# Altium schematic sheet WX0.008.512DL(4).SchDoc
size A3; PageSetup: Record=PageOptions|CenterHorizontal=True|CenterVertical=True|PrintScale=0.73|XCorrection=1.00|YCorrection=1.00|PrintKind=1|BorderSize=5000000|LeftOffset=0|BottomOffset=0|Orientation=2|PaperLength=1000|PaperWidth=1000|Scale=100|PaperSource=7|PrintQuality=-3|MediaType=1|DitherType=10|PrintScaleMode=1|PaperKind=A4 (210 x 297 毫米)|PaperIndex=9
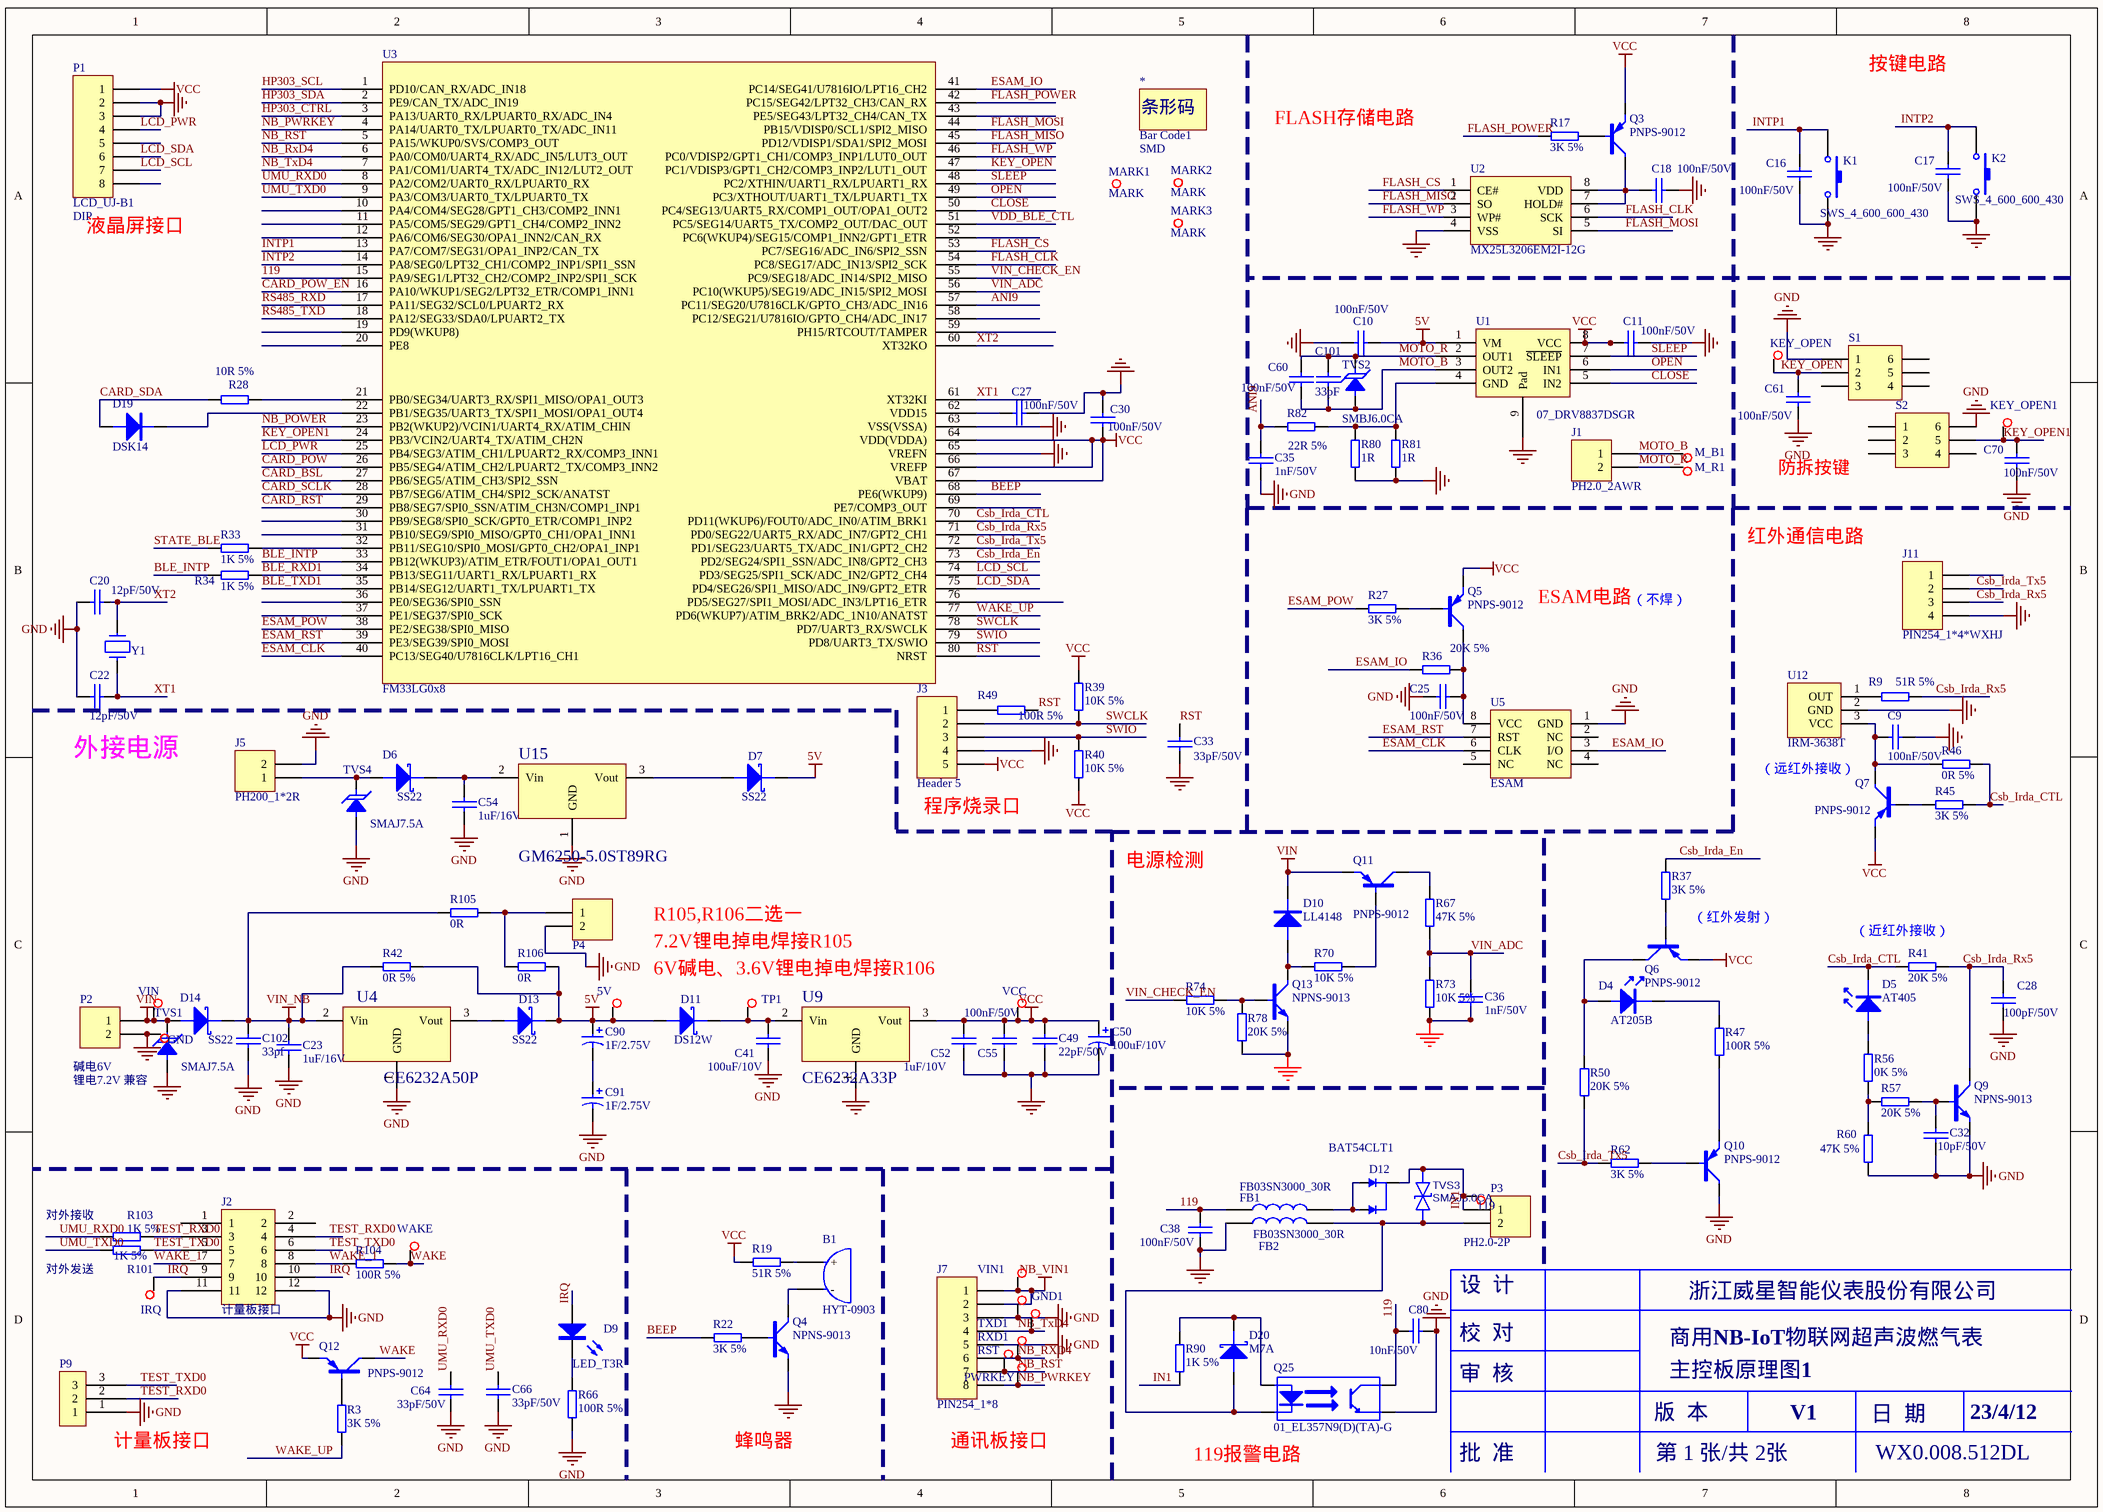
[diagram p0: WX0.008.512DL(4).SchDoc]

## Parts
5V  TEST-PAD  [TEST-PAD]  (value not drawn)
119  TEST-PAD  [TEST-PAD]  (value not drawn)
*  Bar Code1  SMD/DIP: SMD  [Bar Code1]
B1  HYT-0903  [HYT-0903]
C9  100nF/50V  [CAP0603]
C10  100nF/50V  [CAP0603]
C11  100nF/50V  [CAP0603]
C16  100nF/50V  [CAP0603]
C17  100nF/50V  [CAP0603]
C18  100nF/50V  [CAP0603]
C20  12pF/50V  [CAP0603]
C22  12pF/50V  [CAP0603]
C23  1uF/16V  [CAP0603]
C25  100nF/50V  [CAP0603]
C27  100nF/50V  [CAP0603]
C28  100pF/50V  [CAP0603]
C30  100nF/50V  [CAP0603]
C32  10pF/50V  [CAP0603]
C33  33pF/50V  [CAP0603]
C35  1nF/50V  [CAP0603]
C36  1nF/50V  [CAP0603]
C38  100nF/50V  [CAP0603]
C41  100uF/10V  [GRM31CR60J107ME39L]
C49  22pF/50V  [CAP0603]
C50  100uF/10V  [GRM31CR60J107ME39L]
C52  1uF/10V  [CAP0603]
C54  1uF/16V  [CAP0603]
C55  100nF/50V  [CAP0603]
C60  100nF/50V  [CAP0603]
C61  100nF/50V  [CAP0603]
C64  33pF/50V  [CAP0603]
C66  33pF/50V  [CAP0603]
C70  100nF/50V  [CAP0603]
C80  10nF/50V  [CAP0603]
C90  1F/2.75V  [CAPPC_350_800_1600]
C91  1F/2.75V  [CAPPC_350_800_1600]
C101  33pF  [CAP0603]
C102  33pf  [CAP0603]
D4  AT205B  [LEDRED]
D5  AT405  [IR_254_1000_500]
D6  SS22  [DO-214AC]
D7  SS22  [DO-214AC]
D9  LED_T3R  [LED2_300]
D10  LL4148  [SOD-123FL]
D11  DS12W  [SOD-123FL]
D12  BAT54CLT1  [SOT-23]
D13  SS22  [DO-214AC]
D14  SS22  [DO-214AC]
D19  DSK14  [SOD-123FL]
D20  M7A  [DO-214AC]
FB1  FB03SN3000_30R  [IND0603]
FB2  FB03SN3000_30R  [IND0603]
GND  TEST-PAD  [TEST-PAD]  (value not drawn)
GND1  TEST-PAD  [TEST-PAD]  (value not drawn)
IRQ  TEST-PAD  [TEST-PAD]  (value not drawn)
J1  PH2.0_2AWR  [SMT2-2.0]
J2  计量板接口  [计量板插座 2X6Pin]
J3  Header 5  [HDR1X5]
J5  PH200_1*2R  [SMT2-2.0]
J7  PIN254_1*8  [PCBComponent_1 - duplicate3]
J11  PIN254_1*4*WXHJ  [PIN254_1*4*1100S]
K1  SWS_4_600_600_430  [SWS_4_600_600]
K2  SWS_4_600_600_430  [SWS_4_600_600]
KEY_OPEN  TEST-PAD  [TEST-PAD]  (value not drawn)
KEY_OPEN1  TEST-PAD  [TEST-PAD]  (value not drawn)
M_B1  TEST-PAD  [TEST-PAD]  (value not drawn)
M_R1  TEST-PAD  [TEST-PAD]  (value not drawn)
MARK1  MARK  [MARK]
MARK2  MARK  [MARK]
MARK3  MARK  [MARK]
P1  LCD_UJ-B1  SMD/DIP: DIP  [LCD_JR-H25433AFP]
P2  碱电6V  [Header 2]
P3  PH2.0-2P  [SMT2-2.0]
P4  两节锂电池7.2V  [CONN-SMD_2.0-2PLT]  (value not drawn)
P9  Component_2  [PCBComponent_1 - duplicate]  (value not drawn)
PWRKEY  TEST-PAD  [TEST-PAD]  (value not drawn)
Q3  PNPS-9012  [SOT-23]
Q4  NPNS-9013  [SOT-23]
Q5  PNPS-9012  [SOT-23]
Q6  PNPS-9012  [SOT-23]
Q7  PNPS-9012  [SOT-23]
Q9  NPNS-9013  [SOT-23]
Q10  PNPS-9012  [SOT-23]
Q11  PNPS-9012  [SOT-23]
Q12  PNPS-9012  [SOT-23]
Q13  NPNS-9013  [SOT-23]
Q25  01_EL357N9(D)(TA)-G  [EL357D]
R3  3K 5%  [RES0603]
R9  51R 5%  [RES0603]
R17  3K 5%  [RES0603]
R19  51R 5%  [RES0603]
R22  3K 5%  [RES0603]
R27  3K 5%  [RES0603]
R28  10R 5%  [RES0603]
R33  1K 5%  [RES0603]
R34  1K 5%  [RES0603]
R36  20K 5%  [RES0603]
R37  3K 5%  [RES0603]
R39  10K 5%  [RES0603]
R40  10K 5%  [RES0603]
R41  20K 5%  [RES0603]
R42  0R 5%  [RES1206]
R45  3K 5%  [RES0603]
R46  0R 5%  [RES0603]
R47  100R 5%  [RES0603]
R49  100R 5%  [RES0603]
R50  20K 5%  [RES0603]
R56  0K 5%  [RES0603]
R57  20K 5%  [RES0603]
R60  47K 5%  [RES0603]
R62  3K 5%  [RES0603]
R66  100R 5%  [RES0603]
R67  47K 5%  [RES0603]
R70  10K 5%  [RES0603]
R73  10K 5%  [RES0603]
R74  10K 5%  [RES0603]
R78  20K 5%  [RES0603]
R80  1R  [RES1206]
R81  1R  [RES1206]
R82  22R 5%  [RES0603]
R90  1K 5%  [RES0603]
R101  1K 5%  [RES0603]
R103  1K 5%  [RES0603]
R104  100R 5%  [RES0603]
R105  0R  [RES1206]
R106  0R  [RES1206]
RST  TEST-PAD  [TEST-PAD]  (value not drawn)
RXD1  TEST-PAD  [TEST-PAD]  (value not drawn)
S1  Component_4  [PCBComponent_1 - duplicate5]  (value not drawn)
S2  Component_4  [PCBComponent_1 - duplicate5]  (value not drawn)
TP1  TEST-PAD  [TEST-PAD]  (value not drawn)
TVS1  SMAJ7.5A  [PCBComponent_1 - duplicate4]
TVS2  SMBJ6.0CA  [DO-214AA]
TVS3  SMAJ5.0CA  [SMAJ5.0CA]
TVS4  SMAJ7.5A  [PCBComponent_1 - duplicate4]
TXD1  TEST-PAD  [TEST-PAD]  (value not drawn)
U1  07_DRV8837DSGR  [S-PWSON-N8]
U2  MX25L3206EM2I-12G  [SOP-8L-200MIL/SOP-8]
U3  FM33LG0x8  [LQFP80]
U4  CE6232A50P  [SOT-89]
U5  ESAM  [SOP-8]
U9  CE6232A33P  [SOT-89]
U12  IRM-3638T  [接收头]
U15  GM6250-5.0ST89RG  [SOT-89]
VCC  TEST-PAD  [TEST-PAD]  (value not drawn)
VIN  TEST-PAD  [TEST-PAD]  (value not drawn)
VIN1  TEST-PAD  [TEST-PAD]  (value not drawn)
WAKE  TEST-PAD  [TEST-PAD]  (value not drawn)
Y1  XTALSG12MD_32.768kD  [SMD-3215_2P]  (value not drawn)

## Nets
5V: 5V.1 C10.2 C90.1 D7.2 D11.1 D13.2 R42.2 R106.2 U1.1(VM)
GND: C9.1 C10.1 C11.2 C16.1 C17.1 C18.2 C20.1 C22.1 C23.2 C25.2 C27.2 C28.2 C30.1 C32.2 C33.1 C35.2 C36.1 C38.2 C41.2 C49.1 C50.2 C52.2 C54.2 C55.1 C61.1 C64.2 C66.2 C70.1 C80.2 C91.2 C102.2 FB2.1 GND.1 GND1.1 J2.11 J2.12 J3.4 J5.2 J7.3 J7.5 J11.4 K1.2 K2.2 P1.2 P1.3 P2.2 P4.2 P9.1 Q4.2(E) Q9.2(E) Q10.3(C) Q13.2(E) Q25.3 R60.1 R66.2 R73.2 R78.2 R80.1 R81.1 S1.1 S2.6 TVS1.1 TVS4.1 U1.9(Pad) U2.4(VSS) U3.63(VSS(VSSA)) U3.65(VREFN) U4.1(GND) U5.1(GND) U9.1(GND) U12.2(GND) U15.1(GND)
NB_VIN1: J7.1 J7.2 VIN1.1
VCC: C11.1 C30.2 C49.2 C50.1 C52.1 C55.2 J3.5 P1.1 Q3.2(E) Q5.2(E) Q6.2(E) Q7.2(E) Q12.2(E) R19.2 R39.1 R40.1 U1.8(VCC) U3.64(VDD(VDDA)) U3.66(VREFP) U3.67(VBAT) U9.3(Vout) VCC.1
VIN: D10.2 D14.1 P2.1 Q11.2(E) TVS1.2 VIN.1
VIN_NB: C23.1 C102.1 D14.2 R42.1 R105.1 U4.2(Vin)
119: C38.1 C80.1 FB1.1 Q25.4 U3.15(PA9/SEG1/LPT32_CH2/COMP2_INP2/SPI1_SCK)
ANI9: C35.1 R82.1 U3.57(PC11/SEG20/U7816CLK/GPTO_CH3/ADC_IN16)
BEEP: R22.2 U3.68(PE6(WKUP9))
BLE_INTP: R34.2 U3.33(PB12(WKUP3)/ATIM_ETR/FOUT1/OPA1_OUT1)
BLE_RXD1: R34.1 U3.34(PB13/SEG11/UART1_RX/LPUART1_RX)
BLE_TXD1: U3.35(PB14/SEG12/UART1_TX/LPUART1_TX)
CARD_BSL: U3.27(PB6/SEG5/ATIM_CH3/SPI2_SSN)
CARD_POW: U3.26(PB5/SEG4/ATIM_CH2/LPUART2_TX/COMP3_INN2)
CARD_POW_EN: U3.16(PA10/WKUP1/SEG2/LPT32_ETR/COMP1_INN1)
CARD_RST: U3.29(PB8/SEG7/SPI0_SSN/ATIM_CH3N/COMP1_INP1)
CARD_SCLK: U3.28(PB7/SEG6/ATIM_CH4/SPI2_SCK/ANATST)
CARD_SDA: D19.1(A) R28.1
CLOSE: U1.5(IN2) U3.50(PC4/SEG13/UART5_RX/COMP1_OUT/OPA1_OUT2)
Csb_Irda_CTL: D5.2 R41.2 R45.1 R46.1 U3.70(PD11(WKUP6)/FOUT0/ADC_IN0/ATIM_BRK1)
Csb_Irda_En: R37.2 U3.73(PD2/SEG24/SPI1_SSN/ADC_IN8/GPT2_CH3)
Csb_Irda_Rx5: C28.1 J11.3 Q9.3(C) R9.2 R41.1 U3.71(PD0/SEG22/UART5_RX/ADC_IN7/GPT2_CH1)
Csb_Irda_Tx5: J11.2 R50.2 R62.2 U3.72(PD1/SEG23/UART5_TX/ADC_IN1/GPT2_CH2)
ESAM_CLK: U3.40(PC13/SEG40/U7816CLK/LPT16_CH1) U5.6(CLK)
ESAM_IO: R36.1 U3.41(PC14/SEG41/U7816IO/LPT16_CH2) U5.3(I/O)
ESAM_POW: R27.2 U3.38(PE2/SEG38/SPI0_MISO)
ESAM_RST: U3.39(PE3/SEG39/SPI0_MOSI) U5.7(RST)
FLASH_CLK: U2.6(SCK) U3.54(PC8/SEG17/ADC_IN13/SPI2_SCK)
FLASH_CS: U2.1(CE#) U3.53(PC7/SEG16/ADC_IN6/SPI2_SSN)
FLASH_MISO: U2.2(SO) U3.45(PD12/VDISP1/SDA1/SPI2_MOSI)
FLASH_MOSI: U2.5(SI) U3.44(PB15/VDISP0/SCL1/SPI2_MISO)
FLASH_POWER: R17.1 U3.42(PC15/SEG42/LPT32_CH3/CAN_RX)
FLASH_WP: U2.3(WP#) U3.46(PC0/VDISP2/GPT1_CH1/COMP3_INP1/LUT0_OUT)
HP303_CTRL: U3.3(PA13/UART0_RX/LPUART0_RX/ADC_IN4)
HP303_SCL: U3.1(PD10/CAN_RX/ADC_IN18)
HP303_SDA: U3.2(PE9/CAN_TX/ADC_IN19)
IN1: 119.1 D12.3(C) P3.1 R90.1 TVS3.1
INTP1: C16.2 K1.1 U3.13(PA7/COM7/SEG31/OPA1_INP2/CAN_TX)
INTP2: C17.2 K2.1 U3.14(PA8/SEG0/LPT32_CH1/COMP2_INP1/SPI1_SSN)
IRQ: D9.1 IRQ.1 J2.9 J2.10
KEY_OPEN: C61.2 KEY_OPEN.1 S1.2 U3.47(PC1/VDISP3/GPT1_CH2/COMP3_INP2/LUT1_OUT)
KEY_OPEN1: C70.2 KEY_OPEN1.1 S2.5 U3.24(PB3/VCIN2/UART4_TX/ATIM_CH2N)
LCD_PWR: P1.4 U3.25(PB4/SEG3/ATIM_CH1/LPUART2_RX/COMP3_INN1)
LCD_SCL: P1.7 U3.74(PD3/SEG25/SPI1_SCK/ADC_IN2/GPT2_CH4)
LCD_SDA: P1.6 U3.75(PD4/SEG26/SPI1_MISO/ADC_IN9/GPT2_ETR)
MOTO_B: C60.2 C101.2 J1.1 M_B1.1 TVS2.1 U1.3(OUT2)
MOTO_R: C60.1 C101.1 J1.2 M_R1.1 TVS2.2 U1.2(OUT1)
NB_POWER: U3.23(PB2(WKUP2)/VCIN1/UART4_RX/ATIM_CHIN)
NB_PWRKEY: J7.8 PWRKEY.1 U3.4(PA14/UART0_TX/LPUART0_TX/ADC_IN11)
NB_RST: J7.7 RST.1 U3.5(PA15/WKUP0/SVS/COMP3_OUT)
NB_RXD4: J7.6 RXD1.1 U3.6(PA0/COM0/UART4_RX/ADC_IN5/LUT3_OUT)
NB_TxD4: J7.4 TXD1.1 U3.7(PA1/COM1/UART4_TX/ADC_IN12/LUT2_OUT)
OPEN: U1.6(IN1) U3.49(PC3/XTHOUT/UART1_TX/LPUART1_TX)
RS485_RXD: U3.17(PA11/SEG32/SCL0/LPUART2_RX)
RS485_TXD: U3.18(PA12/SEG33/SDA0/LPUART2_TX)
RST: C33.2 R49.1 U3.80(NRST)
SLEEP: U1.7(~{SLEEP}) U3.48(PC2/XTHIN/UART1_RX/LPUART1_RX)
STATE_BLE: R33.2
SWCLK: J3.2 R39.2 U3.78(PD7/UART3_RX/SWCLK)
SWIO: J3.3 R40.2 U3.79(PD8/UART3_TX/SWIO)
TEST_RXD0: J2.3 J2.4 P9.2 R103.1
TEST_TXD0: J2.5 J2.6 P9.3 R101.1
UMU_RXD0: C64.1 R103.2 U3.8(PA2/COM2/UART0_RX/LPUART0_RX)
UMU_TXD0: C66.1 R101.2 U3.9(PA3/COM3/UART0_TX/LPUART0_TX)
VDD_BLE_CTL: U3.51(PC5/SEG14/UART5_TX/COMP2_OUT/DAC_OUT)
VIN_ADC: C36.2 R67.2 R73.1 U3.56(PC10(WKUP5)/SEG19/ADC_IN15/SPI2_MOSI)
VIN_CHECK_EN: R74.1 U3.55(PC9/SEG18/ADC_IN14/SPI2_MISO)
WAKE: Q12.3(C) R104.2 WAKE.1
WAKE_1: J2.7 J2.8 R104.1
WAKE_UP: R3.1 U3.77(PD6(WKUP7)/ATIM_BRK2/ADC_1N10/ANATST)
XT1: C22.2 U3.61(XT32KI) Y1.2
XT2: C20.2 U3.60(XT32KO) Y1.1
NetB1_1: B1.1(+) R19.1
NetB1_2: B1.2(-) Q4.3(C)
NetC9_2: C9.2 Q7.3(C) R46.2 U12.3(VCC)
NetC18_1: C18.1 Q3.3(C) U2.7(HOLD#) U2.8(VDD)
NetC25_1: C25.1 Q5.3(C) R36.2 U5.8(VCC)
NetC27_1: C27.1 U3.62(VDD15)
NetC32_1: C32.1 Q9.1(B) R57.2
NetC41_1: C41.1 D11.2 TP1.1 U9.2(Vin)
NetC54_1: C54.1 D6.2 U15.2(Vin)
NetC90_2: C90.2 C91.1
NetD4_1: D4.1 Q6.3(C) R50.1
NetD4_2: D4.2 R47.1
NetD5_1: D5.1 R56.1
NetD6_1: D6.1 J5.1 TVS4.2
NetD7_1: D7.1 U15.3(Vout)
NetD9_2: D9.2 R66.1
NetD10_1: D10.1 Q13.3(C) R70.1
NetD12_1: D12.1(A) D12.2(A) FB1.2
NetD13_1: D13.1 U4.3(Vout)
NetD19_2: D19.2(K) U3.22(PB1/SEG35/UART3_TX/SPI1_MOSI/OPA1_OUT4)
NetD20_1: D20.1 FB2.2 P3.2 Q25.2 TVS3.2
NetD20_2: D20.2 Q25.1 R90.2
NetJ3_1: J3.1 R49.2
NetP4_1: P4.1 R105.2 R106.1
NetQ3_1: Q3.1(B) R17.2
NetQ4_1: Q4.1(B) R22.1
NetQ5_1: Q5.1(B) R27.1
NetQ6_1: Q6.1(B) R37.1
NetQ7_1: Q7.1(B) R45.2
NetQ10_1: Q10.1(B) R62.1
NetQ10_2: Q10.2(E) R47.2
NetQ11_1: Q11.1(B) R70.2
NetQ11_3: Q11.3(C) R67.1
NetQ12_1: Q12.1(B) R3.2
NetQ13_1: Q13.1(B) R74.2 R78.1
NetR9_1: R9.1 U12.1(OUT)
NetR28_2: R28.2 U3.21(PB0/SEG34/UART3_RX/SPI1_MISO/OPA1_OUT3)
NetR33_1: R33.1 U3.32(PB11/SEG10/SPI0_MOSI/GPT0_CH2/OPA1_INP1)
NetR56_2: R56.2 R57.1 R60.2
NetR80_2: R80.2 R81.2 R82.2 U1.4(GND)

Not connected (* = marked no-connect by the designer): J2 1 2; J11 1; P1 5 8; S1 3 4 5 6; S2 1 2 3 4; U3 10(PA4/COM4/SEG28/GPT1_CH3/COMP2_INN1) 11(PA5/COM5/SEG29/GPT1_CH4/COMP2_INN2) 12(PA6/COM6/SEG30/OPA1_INN2/CAN_RX) 19(PD9(WKUP8)) 20(PE8) 30(PB9/SEG8/SPI0_SCK/GPT0_ETR/COMP1_INP2) 31(PB10/SEG9/SPI0_MISO/GPT0_CH1/OPA1_INN1) 36(PE0/SEG36/SPI0_SSN) 37(PE1/SEG37/SPI0_SCK) 43(PE5/SEG43/LPT32_CH4/CAN_TX) 52(PC6(WKUP4)/SEG15/COMP1_INN2/GPT1_ETR) 58(PC12/SEG21/U7816IO/GPTO_CH4/ADC_IN17) 59(PH15/RTCOUT/TAMPER) 69(PE7/COMP3_OUT) 76(PD5/SEG27/SPI1_MOSI/ADC_IN3/LPT16_ETR); U5 2(NC) 4(NC) 5(NC)

## Notes on the sheet
- 按键电路
- FLASH存储电路
- (near P1) 液晶屏接口
- 防拆按键
- 红外通信电路
- ESAM电路
- （不焊）
- (near C22) 外接电源
- （远红外接收）
- (near J3) 程序烧录口
- R105,R106二选一
- 电源检测
- (near Q6) （红外发射）
- 7.2V锂电掉电焊接R105
- 6V碱电、3.6V锂电掉电焊接R106
- （近红外接收）
- 锂电7.2V 兼容
- 对外接收
- 对外发送
- 设  计
- 浙江威星智能仪表股份有限公司
- (near C80) 审  核
- (near C80) 校  对
- 商用NB-IoT物联网超声波燃气表
- 主控板原理图1
- (near P9) 计量板接口
- 蜂鸣器
- 通讯板接口
- (near Q25) 119报警电路
- 批  准
- 版  本
- 第 1 张/共 2张
- V1
- 日  期
- WX0.008.512DL
- 23/4/12

## Library data of the parts
5V 119 GND GND1 IRQ KEY_OPEN KEY_OPEN1 M_B1 M_R1 PWRKEY RST RXD1 TP1 TXD1 VCC VIN VIN1 WAKE = AD_WXHJ_TEST-PAD_01: 单面焊盘测试点; Part Name: 测试点; ID: 23; SMD/DIP: SMD; Part Number: AD_WXHJ_TEST-PAD_01
* = AD_WXHJ_Bar Code_02: 条形码 ,填充，无需焊接器件; ID: 17; Part Number: AD_WXHJ_Bar Code_02; Part Name: 条形码
B1 = 1010602-0007: 直插,直径9mm,高5.5mm,5 V,2 V,30 mA,兴化市华宇电子有限公司,HYT-0903; Part Name: 有源蜂鸣器; ID: 28; SMD/DIP: DIP; Part Number: 1010602-0007
C9 C16 C17 C25 C27 C30 C35 C38 C60 C61 C70 C80 C101 = 101020103-0021: 104pF,50 V,±10%,0603,国巨,CC0603KRX7R9BB104; Part Name: 0603贴片电容; ID: 3; SMD/DIP: SMD; Part Number: 101020103-0021
C10 C11 C18 C55 = 101020103-0021: 104pF,50 V,±10%,0603,国巨,CC0603KRX7R9BB104; Part Name: 0603贴片电容; ID: 12; SMD/DIP: SMD; Part Number: 101020103-0021
C20 C22 C49 = 101020103-0009: 22pF,50 V,±5%,0603,国巨,CC0603JRNPO9BN22; Part Name: 0603贴片电容; ID: 16; SMD/DIP: SMD; Part Number: 101020103-0009
C23 C54 C102 = 101020103-0003: 105pF,16 V,±10%,0603,国巨,CC0603KRX7R7BB105; Part Name: 0603贴片电容; ID: 14; SMD/DIP: SMD; Part Number: 101020103-0003
C28 = 101020103-0010: 101pf,50 V,±5%,0603,国巨,CC0603JRNP09BN101; Part Name: 0603贴片电容; ID: 4; SMD/DIP: SMD; Part Number: 101020103-0010
C32 = 101020103-0014: 10pF,50 V,±5%,0603,X7R,国巨,CC0603JRNPO9BN100; Part Name: 0603贴片电容; ID: 7; SMD/DIP: SMD; Part Number: 101020103-0014
C33 C64 C66 = 101020103-0027: 33pF,50 V,±10%,0603,国巨,CC0603KRNPO9BN33; Part Name: 0603贴片电容; ID: 17; SMD/DIP: SMD; Part Number: 101020103-0027
C36 = 101020103-0022: 102pF,50 V,±10%,0603,国巨,CC0603KRX7R9BB102; Part Name: 0603贴片电容; ID: 14; SMD/DIP: SMD; Part Number: 101020103-0022
C41 C52 = 101020103-0026: 106pF,10 V,±10%,0603,村田,GRM188R61A106KE47D; Part Name: 0603贴片电容; ID: 8; SMD/DIP: SMD; Part Number: 101020103-0026
C50 = 1010205-0006: 100UF,10 V,±20%,3528,AVX / KEMET,TAJB107M010RNJ; Part Name: 3528贴片钽电容; ID: 5; SMD/DIP: SMD; Part Number: 1010205-0006
C90 C91 = 1010202-0015: 1F,2.75 V,-20%~+20%,8mm*16mm,红宝石,2.7 DMC 1 M MY4 8X16; Part Name: 法拉电容; ID: 12; SMD/DIP: DIP; Part Number: 1010202-0015
D4 = 101040101-0034: 直插,Φ5.8mm圆头透明色，,0.1 A,4 V,5 V,上海品观电子有限公司,AT205B; Part Name: 红外发射管; ID: 37; SMD/DIP: DIP; Part Number: 101040101-0034
D5 = 101040101-0035: Φ5.8mm圆头黑色，光电接收管,Φ5.8mm,0.01 A,1.2 V,60 V,上海品观电子,AT405-PD-01; Part Name: 光敏二极管; ID: 4; SMD/DIP: DIP; Part Number: 101040101-0035
D6 D14 = 101040101-0009: SS12,DO-214AC,1 A,0.55 V,20 V,昶鑫,SS12; Part Name: 贴片肖特基; ID: 14; SMD/DIP: SMD; Part Number: 101040101-0009
D7 D11 D13 = 101040101-0048: DS12W,SOD-123FL,1 A,0.55 V,20 V,领晨科技,DS12W; Part Name: 贴片肖特基; ID: 8; SMD/DIP: SMD; Part Number: 101040101-0048
D9 = 101040102-0001: 圆形插件,3mm 圆形,插件,红光,湖北匡通电子有限公司,3BB4HC; Part Name: 发光二极管; ID: 7; SMD/DIP: DIP; Part Number: 101040102-0001
D10 = 101040101-0005: 4148,4148,0.2 A,1 V,100 V,先科,LL4148; Part Name: 贴片二极管; Text Field1: 010101020002; Text Field2: 10; ID: 11; SMD/DIP: SMD; Part Number: 101040101-0005
D12 = 101040101-0038: BAT54CLT1，SOT23-3,SOT23-3,0.2 A,0.8 V,30 V,安森美,BAT54CLT1; Part Name: 贴片肖特基; ID: 31; SMD/DIP: SMD; Part Number: 101040101-0038
D19 = DIODE: 二极管，Diode
D20 = 101040101-0008: M7A,DO-214AC,1 A,1.1 V,1000 V,杭州闽达电子有限公司,M7A; Part Name: 贴片肖特基; ID: 12; SMD/DIP: SMD; Part Number: 101040101-0008
FB1 FB2 = 109010101-0003: chilisin(奇力新),0603,30Ω ±25% @100MHz,150 V,125 ℃,PBY160808T-300Y-N,-55 ℃,不含铅,,,圆盘,30Ω ±25% @100MHz; Part Name: 磁珠; ID: 25; SMD/DIP: SMD; Part Number: 109010101-0003
J1 = 1010902-0125: PH2.0_2AWR 卧,贴片卧式,母头,单排,2针2.0mm; Part Name: PH座; ID: 27; SMD/DIP: SMD; Part Number: 1010902-0125
J3 = Header 5: Header, 5-Pin
J5 P2 P4 = 1010902-0105: 2.0-2AW,直插弯座，2PIN，脚间距2mm，带防翘起,公头,单排,2.0-2AW;直插弯座，2PIN,脚间距2mm，带防翘起; Part Name: PH座; ID: 11; SMD/DIP: DIP; Part Number: 1010902-0105
J11 = AD_WXHJ_PinHeader_01: 1*4 ，Φ1.0 ，2.54mm，直脚,无需焊接器件; Part Name: 排针; ID: 16; SMD/DIP: DIP; Part Number: AD_WXHJ_PinHeader_01
K1 K2 = 1011001-0026: 松涛,6*6*4.3mm,,6*6*4.3mm,点触,,无铅,6*6*4.3mm; Part Name: 按键; ID: 30; SMD/DIP: SMD; Part Number: 1011001-0026
MARK1-MARK3 = AD_WXHJ_MARK_01: MARK点; ID: 8; SMD/DIP: SMD; Part Number: AD_WXHJ_MARK_01; Part Name: MARK点
P1 = 202020302-0019: UJ-B1,,无取信,,中文,3.3V,无阀门驱动,I²C; Part Name: LCD液晶屏; ID: 16; Part Number: 202020302-0019
P3 = 1010902-0117: PH2.0-2P,2mm间距,母头,单排,PH2.0-2P; Part Name: PH座; ID: 30; SMD/DIP: DIP; Part Number: 1010902-0117
Q3 Q5-Q7 Q10 Q11 = 101040201-0001: 9012,PNP,SOT-23,JCET;长电,S9012; Part Name: 贴片三极管; ID: 17; SMD/DIP: SMD; Part Number: 101040201-0001
Q4 Q9 Q13 = 101040201-0002: 9013,NPN,SOT-23,长电,S9013; Part Name: 贴片三极管; ID: 15; SMD/DIP: SMD; Part Number: 101040201-0002
Q12 = 101040201-0001: 9012,PNP,SOT-23,JCET;长电,S9012; Part Name: 贴片三极管; ID: 16; SMD/DIP: SMD; Part Number: 101040201-0001
Q25 = 1010502-0045: Part Name: 贴片光耦; ID: 31; Part Number: 1010502-0045
R3 R27 R37 R45 R62 = 101010103-0006: 国巨,±5%,0603,,155 ℃,-55 ℃,RC0603JR-073KL,无铅,100 ppm/℃,1/10W,,3K; Part Name: 0603贴片电阻; ID: 22; SMD/DIP: SMD; Part Number: 101010103-0006
R9 = 101010103-0037: 国巨,±5%,0603,,155 ℃,-55 ℃,RC0603JR-0751RL,无铅,100 ppm/℃,1/10W,,51欧; Part Name: 0603贴片电阻; ID: 29; SMD/DIP: SMD; Part Number: 101010103-0037
R17 R22 = 101010103-0006: 国巨,±5%,0603,,155 ℃,-55 ℃,RC0603JR-073KL,无铅,100 ppm/℃,1/10W,,3K; Part Name: 0603贴片电阻; ID: 27; SMD/DIP: SMD; Part Number: 101010103-0006
R19 = 101010103-0037: 国巨,±5%,0603,,155 ℃,-55 ℃,RC0603JR-0751RL,无铅,100 ppm/℃,1/10W,,51欧; Part Name: 0603贴片电阻; ID: 34; SMD/DIP: SMD; Part Number: 101010103-0037
R28 = 101010103-0017: 10R,±5%,1/10W,0603,国巨,RC0603JR-0710RL; Part Name: 0603贴片电阻; ID: 8; SMD/DIP: SMD; Part Number: 101010103-0017
R33 R34 R101 R103 = 101010103-0008: 1K,±5%,1/10W,0603,国巨,RC0603JR-071KL; Part Name: 0603贴片电阻; ID: 10; SMD/DIP: SMD; Part Number: 101010103-0008
R36 R41 R50 R56 R57 R80-R82 = 101010103-0004: 国巨,±5%,0603,,155 ℃,-55 ℃,RC0603JR-0720KL,无铅,200 ppm/℃,1/10W,,20K; Part Name: 0603贴片电阻; ID: 15; SMD/DIP: SMD; Part Number: 101010103-0004
R39 R40 = 101010103-0003: 国巨,±5%,0603,,155 ℃,-55 ℃,RC0603JR-0710KL,无铅,200 ppm/℃,1/10W,,10K; Part Name: 0603贴片电阻; ID: 5; SMD/DIP: SMD; Part Number: 101010103-0003
R42 = 101010101-0013: 0Ω,±5%,1/4W,1206,国巨,RC1206JR-070RL; Part Name: 1206贴片电阻; ID: 2; SMD/DIP: SMD; Part Number: 101010101-0013
R46 = 101010103-0001: 国巨,±5%,0603,,155 ℃,-55 ℃,RC0603J2-070RL,无铅,200 ppm/℃,1/10W,,0R; Part Name: 0603贴片电阻; ID: 1; SMD/DIP: SMD; Part Number: 101010103-0001
R47 R66 R104-R106 = 101010103-0022: 100R,±5%,1/10W,0603,国巨,RC0603JR-07100RL; Part Name: 0603贴片电阻; ID: 5; SMD/DIP: SMD; Part Number: 101010103-0022
R49 = 101010103-0022: 100R,±5%,1/10W,0603,国巨,RC0603JR-07100RL; Part Name: 0603贴片电阻; ID: 4; SMD/DIP: SMD; Part Number: 101010103-0022
R60 = 101010103-0012: 47K,±5%,1/10W,0603,国巨,RC0603JR-0747KL; Part Name: 0603贴片电阻; ID: 25; SMD/DIP: SMD; Part Number: 101010103-0012
R67 = 101010103-0012: 47K,±5%,1/10W,0603,国巨,RC0603JR-0747KL; Part Name: 0603贴片电阻; ID: 30; SMD/DIP: SMD; Part Number: 101010103-0012
R70 R73 R74 = 101010103-0003: 国巨,±5%,0603,,155 ℃,-55 ℃,RC0603JR-0710KL,无铅,200 ppm/℃,1/10W,,10K; Part Name: 0603贴片电阻; ID: 7; SMD/DIP: SMD; Part Number: 101010103-0003
R78 = 101010103-0004: 国巨,±5%,0603,,155 ℃,-55 ℃,RC0603JR-0720KL,无铅,200 ppm/℃,1/10W,,20K; Part Name: 0603贴片电阻; ID: 16; SMD/DIP: SMD; Part Number: 101010103-0004
R90 = 101010103-0008: 1K±5%,1/10W,0603; Part Name: 0603贴片电阻; ID: 38; Part Number: 101010103-0008
TVS1 TVS2 TVS4 = 101040101-0024: SMBJ6.0CA,DO-214AA,10.3 V,6.0 V,600 W,58.3 A,800 uA,上海君耀电子有限公司,SMBJ6.0CA; Part Name: TVS管; ID: 23; SMD/DIP: SMD; Part Number: 101040101-0024
TVS3 = SMAJ5.0CA_C693487: BOM_Manufacturer: FTR; Contributor: LCSC; BOM_Supplier: LCSC; BOM_Supplier Part: C693487; BOM_Manufacturer Part: SMAJ5.0CA; BOM_JLCPCB Part Class: Extended Part; spicePre: D; spiceSymbolName: SMAJ5.0CA_C693487
U1 = 101050101-0060: DRV8837DSGR,S-PWSON-N8,TI,DRV8837DSGR; Part Name: 驱动芯片; ID: 25; SMD/DIP: SMD; Part Number: 101050101-0060
U2 = 101050101-0028: MX25L3206EM2I-12G,SOP-8,旺宏电子,MX25L3206EM2I-12G; Part Name: 存储芯片; ID: 14; SMD/DIP: SMD; Part Number: 101050101-0028
U4 = 1010503-0028: CE6232A50P,CE6232A50P,SOT89-3,8 V,1.8 V,0.11 V,5 V,500mA,0.8 uA,南京芯力微电子有限公司; Part Name: 贴片稳压器; ID: 6; SMD/DIP: SMD; Part Number: 1010503-0028
U5 = AD_XN_ESAM_01: ESAM虚拟器件; Part Name: ESAM芯片; ID: 11; SMD/DIP: SMD; Part Number: AD_XN_ESAM_01
U9 = 1010503-0029: CE6232-3.3,CE6232-3.3,SOT89-3,8V,1.8V,0.11V,3.3V,300mA,0.8uA,南京芯力微电子有限公司; Part Name: 线性稳压芯片; ID: 5; SMD/DIP: SMD; Part Number: 1010503-0029
U12 = 101040101-0003: Part Name: 红外接收头; ID: 39; SMD/DIP: DIP; Part Number: 101040101-0003
U15 = 1010503-0021: GM6250-5.0ST89RG,GM6250-5.0ST89RG,SOT-89,12 V,0 V,0 V,5 V,250mA,1.0 uA,美国GAMMA; ID: 3; SMD/DIP: SMD; Part Number: 1010503-0021; Part Name: GM6250-5.0ST89RG
Y1 = 1010601-0009: SCX3215(SCX3213089);32.768kHz;精度20%;负载电容12.5pF,3215,32.768kHz,0.03 ppm/℃,无源,Q-SC32S03220C5AAAF,SCX3215; Part Name: 贴片晶振; ID: 19; SMD/DIP: SMD; Part Number: 1010601-0009